# Altium schematic sheet Other_Connectors.SchDoc
size A; SheetNumber: 6; SheetTotal: 8
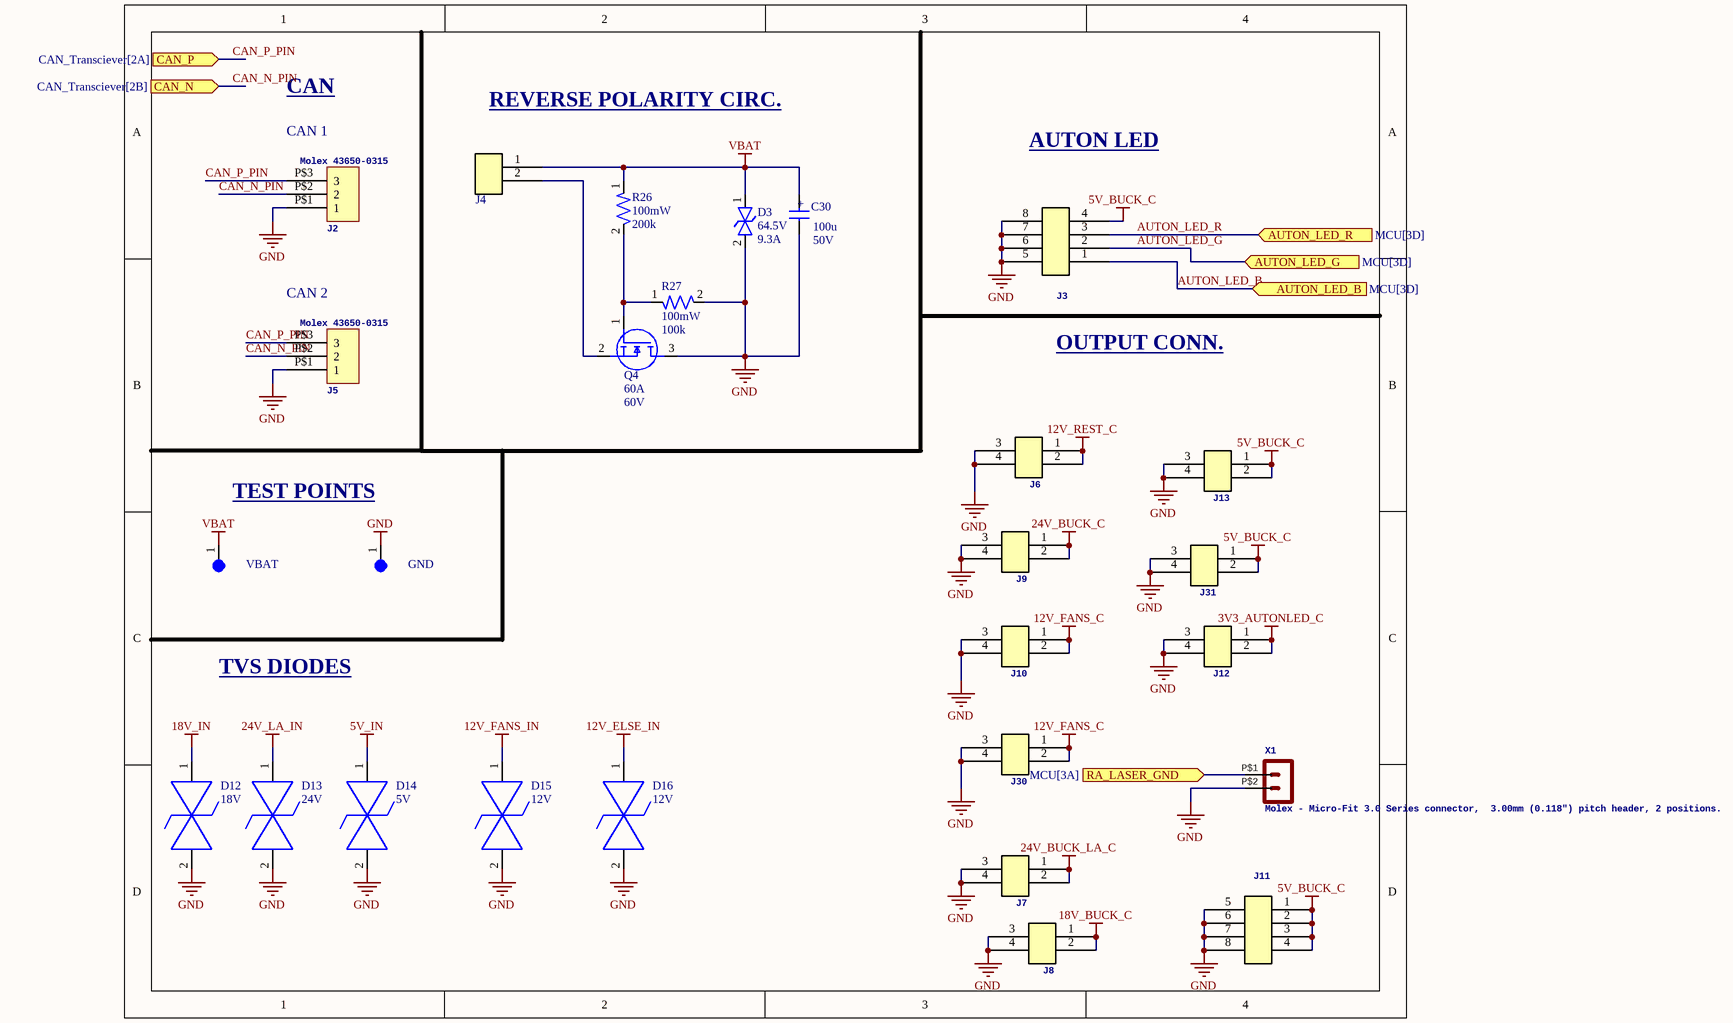
[diagram p0: Other_Connectors.SchDoc]

## Parts
C30  Capacitance: 100u  Voltage: 50V  [WCAP-ATUL_8X11.5(DXL)]  (hidden comment: 860040674004)
D3  Voltage Rating: 64.5V  Current Rating: 9.3A  [DO-214AA (SMBJ)]  (hidden comment: SMBJ40CA)
D12  Clamping Voltage: 18V  [SMBJSeries_LTF]  (hidden comment: SMBJ18)
D13  Voltage: 24V  [SMBJSeries_LTF]  (hidden comment: SMBJ24)
D14  Voltage: 5V  [SMBJSeries_LTF]  (hidden comment: SMBJ5.0)
D15  Voltage: 12V  [SMBJSeries_LTF]  (hidden comment: SMBJ12)
D16  Voltage: 12V  [SMBJSeries_LTF]  (hidden comment: SMBJ12)
GND  5003  [TEST-POINT-0001]  (value not drawn)
J2  Molex 43650-0315  [43650-0315]
J3  Molex 43045-0812  [CONN-8POS-0001]  (value not drawn)
J4  1546927-2  [CONN-1546927-2]  (value not drawn)
J5  Molex 43650-0315  [43650-0315]
J6  Molex 43045-0412  [CONN-4POS-0002]  (value not drawn)
J7  Molex 43045-0412  [CONN-4POS-0002]  (value not drawn)
J8  Molex 43045-0412  [CONN-4POS-0002]  (value not drawn)
J9  Molex 43045-0412  [CONN-4POS-0002]  (value not drawn)
J10  Molex 43045-0412  [CONN-4POS-0002]  (value not drawn)
J11  Molex 43045-0812  [CONN-8POS-0001]  (value not drawn)
J12  Molex 43045-0412  [CONN-4POS-0002]  (value not drawn)
J13  Molex 43045-0412  [CONN-4POS-0002]  (value not drawn)
J30  Molex 43045-0412  [CONN-4POS-0002]  (value not drawn)
J31  Molex 43045-0412  [CONN-4POS-0002]  (value not drawn)
Q4  Voltage: 60V  Continuous Current: 60A  [IC-8VSONCLIP]  (hidden comment: CSD18543Q3AT)
R26  Power: 100mW  Resistance: 200k  [RES-0603]  (hidden comment: RC0603FR-07200KL)
R27  Power: 100mW  Resistance: 100k  [RES-0603]  (hidden comment: RC0603FR-07100KL)
VBAT  5003  [TEST-POINT-0001]  (value not drawn)
X1  Molex - Micro-Fit 3.0 Series connector,  3.00mm (0.118") pitch header, 2 positions.  [43045-0212]

## Ports
AUTON_LED_B (in, see MCU[3D]), AUTON_LED_G (in, see MCU[3D]), AUTON_LED_R (in, see MCU[3D]), CAN_N (in, see CAN_Transciever[2B]), CAN_P (in, see CAN_Transciever[2A]), RA_LASER_GND (in, see MCU[3A])

## Nets
3V3_AUTONLED_C: J12.1 J12.2
5V_BUCK_C: J3.4 J11.1 J11.2 J11.3 J11.4 J13.1 J13.2 J31.1 J31.2
5V_IN: D14.1
12V_ELSE_IN: D16.1
12V_FANS_C: J10.1 J10.2 J30.1 J30.2
12V_FANS_IN: D15.1
12V_REST_C: J6.1 J6.2
18V_BUCK_C: J8.1 J8.2
18V_IN: D12.1
24V_BUCK_C: J9.1 J9.2
24V_BUCK_LA_C: J7.1 J7.2
24V_LA_IN: D13.1
GND: C30.2(NEG) D3.2 D12.2 D13.2 D14.2 D15.2 D16.2 GND.1 J2.P$1(1) J3.5 J3.6 J3.7 J3.8 J5.P$1(1) J6.3 J6.4 J7.3 J7.4 J8.3 J8.4 J9.3 J9.4 J10.3 J10.4 J11.5 J11.6 J11.7 J11.8 J12.3 J12.4 J13.3 J13.4 J30.3 J30.4 J31.3 J31.4 Q4.3(D) R27.2 X1.P$2
VBAT: C30.1(POS) D3.1 J4.1 R26.1 VBAT.1
AUTON_LED_B: J3.1 ; port AUTON_LED_B
AUTON_LED_G: J3.2 ; port AUTON_LED_G
AUTON_LED_R: J3.3 ; port AUTON_LED_R
CAN_N_PIN: J2.P$2(2) J5.P$2(2) ; port CAN_N
CAN_P_PIN: J2.P$3(3) J5.P$3(3) ; port CAN_P
RA_LASER_GND: X1.P$1 ; port RA_LASER_GND
NetJ4_2: J4.2 Q4.2(S)
NetQ4_1: Q4.1(G) R26.2 R27.1

## Notes on the sheet
- CAN
- (near J2) CAN 1
- REVERSE POLARITY CIRC.
- AUTON LED
- (near J5) CAN 2
- OUTPUT CONN.
- TEST POINTS
- TVS DIODES
- (in symbol CAP-100U-0002) +

## Library data of the parts
C30 = CAP-100U-0002: 100 µF 50 V Aluminum Electrolytic Capacitors Radial, Can 7000 Hrs @ 105°C
D3 = DIO-TVS-0001: TVS DIODE 40VWM 64.5VC DO214AA; ComponentLink1Description: Datasheet; ComponentLink1URL: https://www.littelfuse.com/media?resourcetype=datasheets&itemid=09a6ae9a-73cb-4ac4-acac-e6dab92ab953&filename=littelfuse_tvs_diode_smbj_datasheet.pdf
D12 = DIODE-18V-0001: 30.66V Clamp 20.6A Ipp Tvs Diode Surface Mount DO-214AA (SMBJ); Manufacturer_Name: Littelfuse Inc; Copyright: Copyright (C) 2025 Ultra Librarian. All rights reserved.; Manufacturer_Part_Number: SMBJ18
D13 = DIO-TVS-24V: 40.85V Clamp 15.5A Ipp Tvs Diode Surface Mount DO-214AA (SMBJ)
D14 = DIO-TVS-5V: 9.66V Clamp 65.3A Ipp Tvs Diode Surface Mount DO-214AA (SMBJ)
D15 D16 = DIO-TVS-12V: 20.9V Clamp 30.2A Ipp Tvs Diode Surface Mount DO-214AA (SMBJ)
GND VBAT = TEST-POINT-0001: Oranange PC Test Point, Miniature Phoisphor Bronze Silver Plating Through Hole Mounting Type
J2 J5 = Micro-Fit Molex 3 Pin Vertical: GateName_1: G$1; SymbolName_1: HEADER_POS3; DeviceSetName: HEADER_POS3_?; DeviceName: 43650-0315; LibraryName: con-molex-micro-fit-3_0_2; Package: 43650-0315
J3 J11 = CONN-8POS-0001: GateName_1: G$1; SymbolName_1: HEADER_POS8; DeviceSetName: HEADER_POS8_?; DeviceName: 43045-0812; LibraryName: con-molex-micro-fit-3_0_2; Package: 43045-0812
J4 = CONN-2POS-0003
J6-J10 J12 J13 J30 J31 = CONN-4POS-0002: CONN HEADER VERT 4POS 3MM; ComponentLink1Description: Datasheet; ComponentLink1URL: https://www.molex.com/content/dam/molex/molex-dot-com/products/automated/en-us/salesdrawingpdf/430/43045/430450412_sd.pdf?inline
Q4 = NMOS-60A-0001: MOSFET N-CH 60V 12A/60A 8VSON; ComponentLink2Description: Datasheet; ComponentLink2URL: http://www.ti.com/lit/ds/symlink/csd18543q3a.pdf
R26 = RES-200k-0001: RES SMD 200K OHM 1% 1/10W 0603; Tolerance: 1%; Size: 0603; ComponentLink1Description: Datasheet; ComponentLink1URL: https://www.yageo.com/upload/media/product/products/datasheet/rchip/PYu-RC_Group_51_RoHS_L_12.pdf
R27 = RES-100k-0001: RES SMD 100K OHM 1% 1/10W 0603; Tolerance: 1%; Size: 0603; ComponentLink1Description: Datasheet; ComponentLink1URL: https://www.yageo.com/upload/media/product/products/datasheet/rchip/PYu-RC_Group_51_RoHS_L_12.pdf
X1 = HEADER_POS2_?43045-0212: GateName_1: G$1; SymbolName_1: HEADER_POS2; DeviceName: 43045-0212; LibraryName: con-molex-micro-fit-3_0_2; DeviceSetName: HEADER_POS2_?; Package: 43045-0212